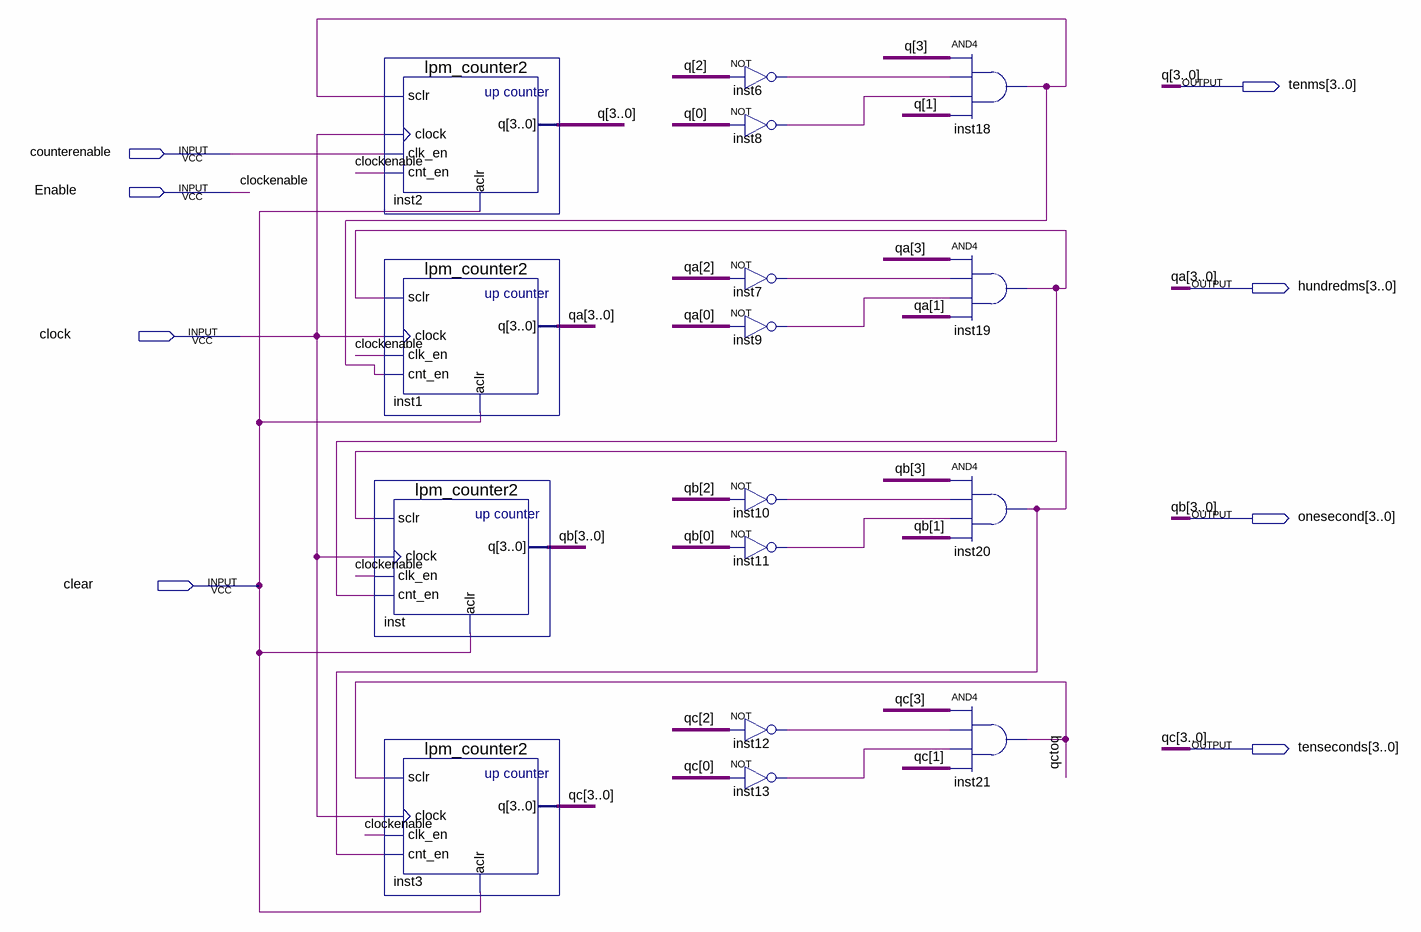
[diagram p0: schematic sheet]
// Quartus schematic counter.bdf as structural Verilog: 16 symbols, 8 pins
module counter (
  input  counterenable,
  input  Enable,
  input  clock,
  input  clear,
  output [3:0] tenms,
  output [3:0] hundredms,
  output [3:0] onesecond,
  output [3:0] tenseconds
);

  wire inst6_out, inst7_out, inst8_out, inst9_out, inst10_out, inst11_out, inst12_out, inst13_out,
       inst18_out, inst19_out, inst20_out, qctoq;

  lpm_counter2 inst2 (
    .sclr(inst18_out), .clock(clock), .clk_en(counterenable), .cnt_en(Enable), .aclr(clear), .q(tenms));
  lpm_counter2 inst1 (
    .sclr(inst19_out), .clock(clock), .clk_en(Enable), .cnt_en(inst18_out), .aclr(clear), .q(hundredms));
  lpm_counter2 inst (
    .sclr(inst20_out), .clock(clock), .clk_en(Enable), .cnt_en(inst19_out), .aclr(clear), .q(onesecond));
  lpm_counter2 inst3 (.sclr(qctoq), .clock(clock), .clk_en(Enable), .cnt_en(inst20_out), .aclr(clear), .q(tenseconds));
  not inst6 (inst6_out, tenms[2]);
  not inst8 (inst8_out, tenms[0]);
  not inst7 (inst7_out, hundredms[2]);
  not inst9 (inst9_out, hundredms[0]);
  not inst10 (inst10_out, onesecond[2]);
  not inst11 (inst11_out, onesecond[0]);
  not inst12 (inst12_out, tenseconds[2]);
  not inst13 (inst13_out, tenseconds[0]);
  and inst18 (inst18_out, tenms[3], inst6_out, inst8_out, tenms[1]);
  and inst19 (inst19_out, hundredms[3], inst7_out, inst9_out, hundredms[1]);
  and inst20 (inst20_out, onesecond[3], inst10_out, inst11_out, onesecond[1]);
  and inst21 (qctoq, tenseconds[3], inst12_out, inst13_out, tenseconds[1]);

  // Other names for the same wires on the sheet: clockenable = Enable; q[3:0] = tenms; qa[3:0] = hundredms;
  //   qb[3:0] = onesecond; qc[3:0] = tenseconds
endmodule
